# Altium schematic sheet PWM_OUTPUT.SchDoc
size A3; Date: *******; ApprovedBy: *******; CheckedBy: None; Author: *******; CompanyName: *******; DrawnBy: V.HIEU; Engineer: *******; Organization: *******; Address2: *******; Address3: *******; Address4: *******; DocumentNumber: Doc Num; Revision: V1.0; Email: truongvanhieu17102005@gmail.com; CurrentTime: *******; CurrentDate: *******; Time: *******; DocumentFullPathAndName: *******; DocumentName: *******; ModifiedDate: *******; ImagePath: *******; ProjectName: *******; Application_BuildNumber: *******
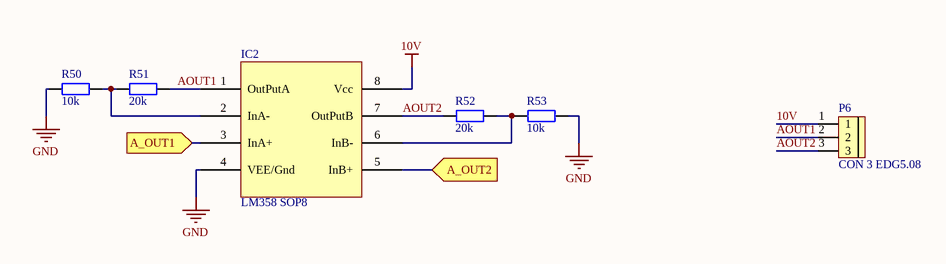
[diagram p0: PWM_OUTPUT.SchDoc]

## Parts
IC2  LM358 SOP8  [SOP 8]
P6  CON 3 EDG5.08  [CON 3 3EDG5.08]
R50  10k  [tro smd 0805]
R51  20k  [tro smd 0805]
R52  20k  [tro smd 0805]
R53  10k  [tro smd 0805]

## Ports
A_OUT1 (in), A_OUT2 (in)

## Nets
10V: IC2.8(Vcc) P6.1
GND: IC2.4(VEE/Gnd) R50.1 R53.2
A_OUT1: IC2.3(InA+) ; port A_OUT1
A_OUT2: IC2.5(InB+) ; port A_OUT2
AOUT1: IC2.1(OutPutA) P6.2 R51.2
AOUT2: IC2.7(OutPutB) P6.3 R52.1
NetIC2_2: IC2.2(InA-) R50.2 R51.1
NetIC2_6: IC2.6(InB-) R52.2 R53.1

## Notes on the sheet
- Title:
- Size:
- Drawn By:
- Page Contents:
- A3
- Number:
- Checked By:
- Revision:
- Date:
- File:
- License:
- Email:
- Time:
- Sheet
- Website:
- of

## Library data of the parts
IC2 = LM358 SOP8: Dán; Ma_Hang: MH000609; Don_Vi: Con; Ten_Linh_Kien: LM358 SOP8; Kieu_Chan: *; Ghi_Chu: *; Chung_Loai: Dán
P6 = CON 3 EDG5.08: Cắm; Ten_Linh_Kien: CON 3 2EDG5.08-3P 5.08MM ( Xanh Cong); Ma_Hang: MH000760; Ghi_Chu: *; Kieu_Chan: *; Don_Vi: Con; Chung_Loai: Cắm
R50 R53 = Tro 0805 1% 10k: Dán; Don_Vi: Con; So_Chan: 2; Ten_Linh_Kien: Trở 0805 1% 10k; Ma_Hang: MH005473; Chung_Loai: Dán; Kieu_Chan: *
R51 R52 = Tro 0805 5% 20k: Dán; Don_Vi: Con; So_Chan: 2; Ten_Linh_Kien: Trở 0805 5% 20k; Ma_Hang: MH005247; Chung_Loai: Dán; Kieu_Chan: *